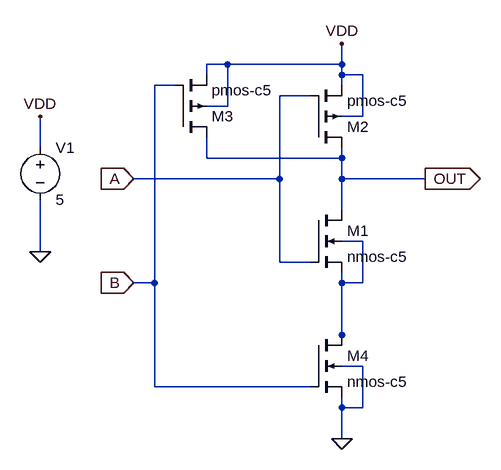
[diagram p0: schematic NAND.asc]
NAND.asc, the LTspice schematic file:
Version 4
SHEET 1 880 688
WIRE 320 96 288 96
WIRE 496 96 496 64
WIRE 496 96 320 96
WIRE 288 112 288 96
WIRE 496 112 496 96
WIRE 528 112 496 112
WIRE 240 128 208 128
WIRE 496 128 496 112
WIRE 448 144 400 144
WIRE 320 160 320 96
WIRE 320 160 288 160
WIRE 528 176 528 112
WIRE 528 176 496 176
WIRE 32 224 32 176
WIRE 288 240 288 208
WIRE 496 240 496 224
WIRE 496 240 288 240
WIRE 400 272 400 144
WIRE 400 272 176 272
WIRE 496 272 496 240
WIRE 624 272 496 272
WIRE 496 320 496 272
WIRE 528 368 496 368
WIRE 32 384 32 304
WIRE 400 400 400 272
WIRE 448 400 400 400
WIRE 208 432 208 128
WIRE 208 432 176 432
WIRE 496 432 496 416
WIRE 528 432 528 368
WIRE 528 432 496 432
WIRE 496 512 496 432
WIRE 496 528 496 512
WIRE 528 560 496 560
WIRE 208 592 208 432
WIRE 448 592 208 592
WIRE 496 624 496 608
WIRE 528 624 528 560
WIRE 528 624 496 624
WIRE 496 672 496 624
FLAG 496 64 VDD
FLAG 624 272 OUT
IOPIN 624 272 Out
FLAG 32 384 0
FLAG 32 176 VDD
FLAG 496 672 0
FLAG 176 272 A
IOPIN 176 272 In
FLAG 176 432 B
IOPIN 176 432 In
SYMBOL nmos4 448 320 R0
SYMATTR InstName M1
SYMATTR Value nmos-c5
SYMATTR Value2 l=1u w=1u
SYMBOL pmos4 448 224 M180
SYMATTR InstName M2
SYMATTR Value pmos-c5
SYMATTR Value2 l=1u w=1.5u
SYMBOL voltage 32 208 R0
SYMATTR InstName V1
SYMATTR Value 5
SYMBOL pmos4 240 208 M180
SYMATTR InstName M3
SYMATTR Value pmos-c5
SYMATTR Value2 l=1u w=1.5u
SYMBOL nmos4 448 512 R0
SYMATTR InstName M4
SYMATTR Value nmos-c5
SYMATTR Value2 l=1u w=1u

The netlist it stands for:
* NAND.asc
M1 OUT A N001 N001 nmos-c5 l=1u w=1u
M2 OUT A VDD VDD pmos-c5 l=1u w=1.5u
V1 VDD 0 5
M3 OUT B VDD VDD pmos-c5 l=1u w=1.5u
M4 N001 B 0 0 nmos-c5 l=1u w=1u
.model NMOS NMOS
.model PMOS PMOS
.lib standard.mos
.backanno
.end